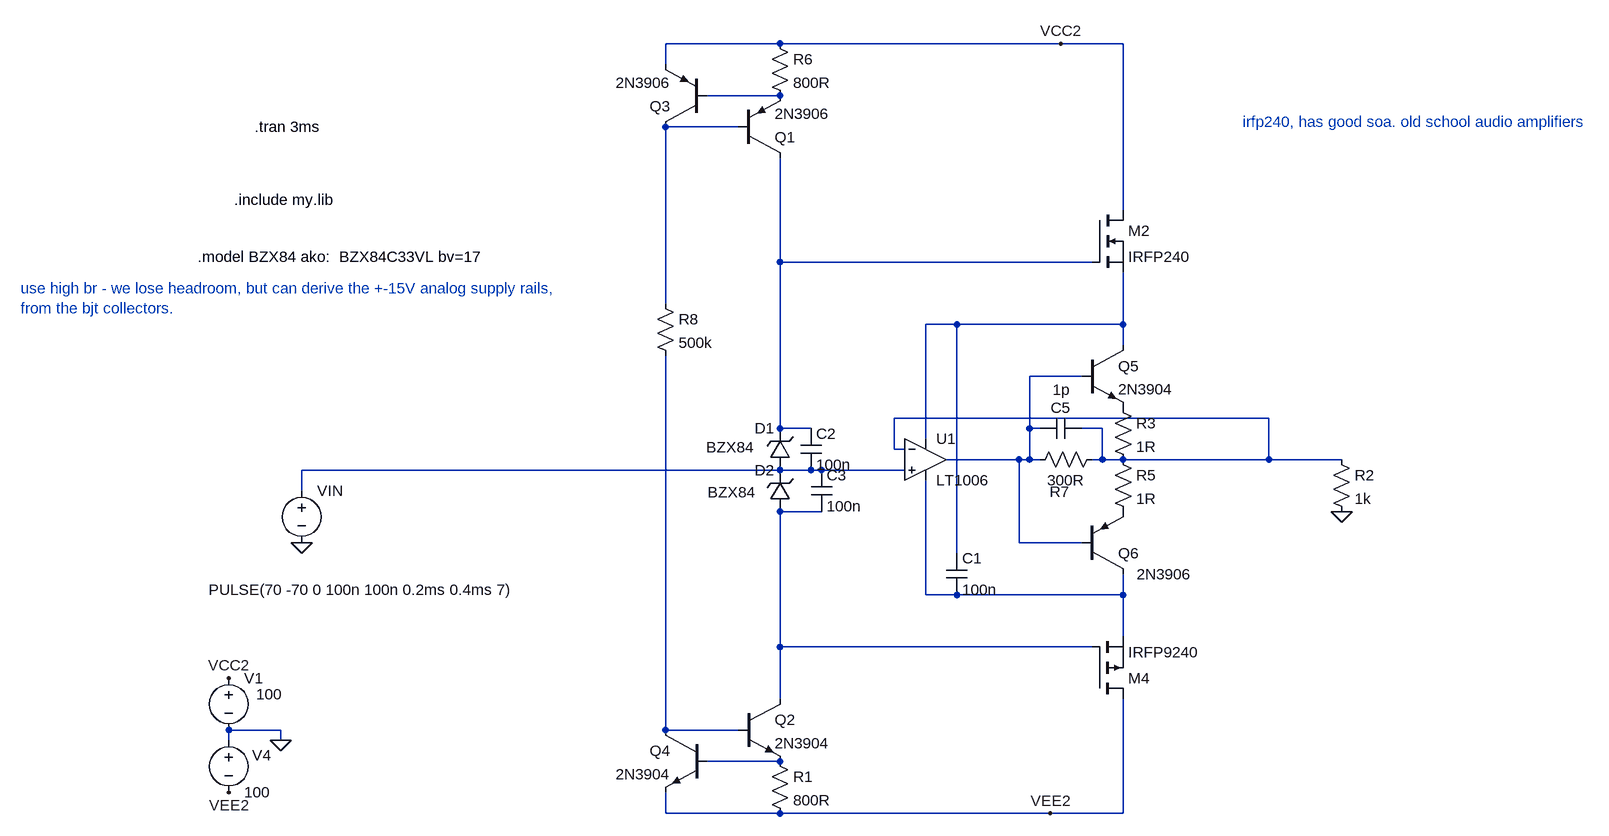
[diagram p0: schematic Draft05.asc]
Draft05.asc, the LTspice schematic file:
Version 4
SHEET 1 2364 896
WIRE 704 -416 528 -416
WIRE 1136 -416 704 -416
WIRE 1232 -416 1136 -416
WIRE 528 -384 528 -416
WIRE 704 -336 592 -336
WIRE 640 -288 528 -288
WIRE 1232 -160 1232 -416
WIRE 704 -80 704 -240
WIRE 1184 -80 704 -80
WIRE 528 -16 528 -288
WIRE 976 16 928 16
WIRE 1232 16 1232 -64
WIRE 1232 16 976 16
WIRE 1232 48 1232 16
WIRE 1168 96 1088 96
WIRE 1456 160 880 160
WIRE 704 176 704 -80
WIRE 752 176 704 176
WIRE 1088 176 1088 96
WIRE 1104 176 1088 176
WIRE 1200 176 1168 176
WIRE 928 192 928 16
WIRE 880 208 880 160
WIRE 896 208 880 208
WIRE 1072 224 960 224
WIRE 1088 224 1088 176
WIRE 1088 224 1072 224
WIRE 1104 224 1088 224
WIRE 1200 224 1200 176
WIRE 1200 224 1184 224
WIRE 1232 224 1200 224
WIRE 1456 224 1456 160
WIRE 1456 224 1232 224
WIRE 1568 224 1456 224
WIRE 704 240 -32 240
WIRE 752 240 704 240
WIRE 768 240 752 240
WIRE 896 240 768 240
WIRE -32 272 -32 240
WIRE 768 304 704 304
WIRE 1072 352 1072 224
WIRE 1168 352 1072 352
WIRE 976 368 976 16
WIRE 928 432 928 256
WIRE 976 432 928 432
WIRE 1232 432 1232 400
WIRE 1232 432 976 432
WIRE 1232 496 1232 432
WIRE 704 512 704 304
WIRE 1184 512 704 512
WIRE 704 592 704 512
WIRE -64 640 -144 640
WIRE 528 640 528 64
WIRE 640 640 528 640
WIRE -144 656 -144 640
WIRE -64 656 -64 640
WIRE 704 688 592 688
WIRE 528 768 528 736
WIRE 704 768 528 768
WIRE 1120 768 704 768
WIRE 1232 768 1232 592
WIRE 1232 768 1120 768
FLAG -32 352 0
FLAG -64 656 0
FLAG -144 560 VCC2
FLAG -144 736 VEE2
FLAG 1136 -416 VCC2
FLAG 1120 768 VEE2
FLAG 1568 304 0
SYMBOL voltage -32 256 R0
WINDOW 123 0 0 Left 0
WINDOW 39 0 0 Left 0
WINDOW 3 -143 168 Left 2
SYMATTR Value PULSE(70 -70 0 100n 100n 0.2ms 0.4ms 7)
SYMATTR InstName VIN
SYMBOL pnp 640 -240 M180
SYMATTR InstName Q1
SYMATTR Value 2N3906
SYMBOL pnp 592 -288 R180
SYMATTR InstName Q3
SYMATTR Value 2N3906
SYMBOL res 688 -432 R0
SYMATTR InstName R6
SYMATTR Value 800R
SYMBOL voltage -144 544 R0
WINDOW 123 0 0 Left 0
WINDOW 39 0 0 Left 0
WINDOW 3 42 41 Left 2
SYMATTR Value 100
SYMATTR InstName V1
SYMBOL voltage -144 640 R0
WINDOW 123 0 0 Left 0
WINDOW 39 0 0 Left 0
WINDOW 0 36 39 Left 2
SYMATTR InstName V4
SYMATTR Value 100
SYMBOL res 512 -32 R0
SYMATTR InstName R8
SYMATTR Value 500k
SYMBOL zener 720 240 R180
WINDOW 0 24 64 Left 2
WINDOW 3 56 35 Left 2
SYMATTR InstName D1
SYMATTR Value BZX84
SYMBOL zener 720 304 R180
WINDOW 0 24 64 Left 2
WINDOW 3 54 30 Left 2
SYMATTR InstName D2
SYMATTR Value BZX84
SYMBOL npn 640 592 R0
SYMATTR InstName Q2
SYMATTR Value 2N3904
SYMBOL res 688 672 R0
SYMATTR InstName R1
SYMATTR Value 800R
SYMBOL npn 592 640 M0
SYMATTR InstName Q4
SYMATTR Value 2N3904
SYMBOL npn 1168 48 R0
SYMATTR InstName Q5
SYMATTR Value 2N3904
SYMBOL pnp 1168 400 M180
WINDOW 3 85 0 Left 2
SYMATTR InstName Q6
SYMATTR Value 2N3906
SYMBOL res 1216 128 R0
SYMATTR InstName R3
SYMATTR Value 1R
SYMBOL res 1216 208 R0
SYMATTR InstName R5
SYMATTR Value 1R
SYMBOL res 1200 208 R90
WINDOW 0 81 66 VBottom 2
WINDOW 3 32 56 VTop 2
SYMATTR InstName R7
SYMATTR Value 300R
SYMBOL nmos 1184 -160 R0
SYMATTR InstName M2
SYMATTR Value IRFP240
SYMBOL pmos 1184 592 M180
SYMATTR InstName M4
SYMATTR Value IRFP9240
SYMBOL OpAmps\\LT1006 928 160 R0
SYMATTR InstName U1
SYMBOL cap 736 176 R0
SYMATTR InstName C2
SYMATTR Value 100n
SYMBOL cap 752 240 R0
SYMATTR InstName C3
SYMATTR Value 100n
SYMBOL cap 1168 160 R90
WINDOW 0 0 32 VBottom 2
WINDOW 3 -59 31 VTop 2
SYMATTR InstName C5
SYMATTR Value 1p
SYMBOL res 1552 208 R0
SYMATTR InstName R2
SYMATTR Value 1k
SYMBOL cap 960 368 R0
SYMATTR InstName C1
SYMATTR Value 100n
TEXT -104 -288 Left 2 !.tran 3ms
TEXT -136 -176 Left 2 !.include my.lib
TEXT -192 -88 Left 2 !.model BZX84 ako:  BZX84C33VL bv=17
TEXT -464 -40 Left 2 ;use high br - we lose headroom, but can derive the +-15V analog supply rails,\nfrom the bjt collectors.
TEXT 1416 -296 Left 2 ;irfp240, has good soa. old school audio amplifiers

The netlist it stands for:
* Draft05.asc
VIN N007 0 PULSE(70 -70 0 100n 100n 0.2ms 0.4ms 7)
Q1 N003 N002 N001 0 2N3906
Q3 N002 N001 VCC2 0 2N3906
R6 VCC2 N001 800R
V1 VCC2 0 100
V4 0 VEE2 100
R8 N002 N010 500k
D1 N007 N003 BZX84
D2 N008 N007 BZX84
Q2 N008 N010 N011 0 2N3904
R1 N011 VEE2 800R
Q4 N010 N011 VEE2 0 2N3904
Q5 N004 N005 P001 0 2N3904
Q6 N009 N005 P002 0 2N3906
R3 P001 N006 1R
R5 N006 P002 1R
R7 N006 N005 300R
M2 VCC2 N003 N004 N004 IRFP240
M4 VEE2 N008 N009 N009 IRFP9240
XU1 N007 N006 N004 N009 N005 LT1006  ; pins In+ In- V+ V- OUT
C2 N003 N007 100n
C3 N007 N008 100n
C5 N006 N005 1p
R2 N006 0 1k
C1 N004 N009 100n
.model D D
.lib standard.dio
.model NPN NPN
.model PNP PNP
.lib standard.bjt
.model NMOS NMOS
.model PMOS PMOS
.lib standard.mos
.tran 3ms
.include my.lib
.model BZX84 ako:  BZX84C33VL bv=17
* use high br - we lose headroom, but can derive the +-15V analog supply rails,
* from the bjt collectors.
* irfp240, has good soa. old school audio amplifiers
.lib LTC.lib
.backanno
.end